# EAGLE design Control.Board (EAGLE 6.6.0)

## Sheet 1 of 8: Интеграция с датчиками
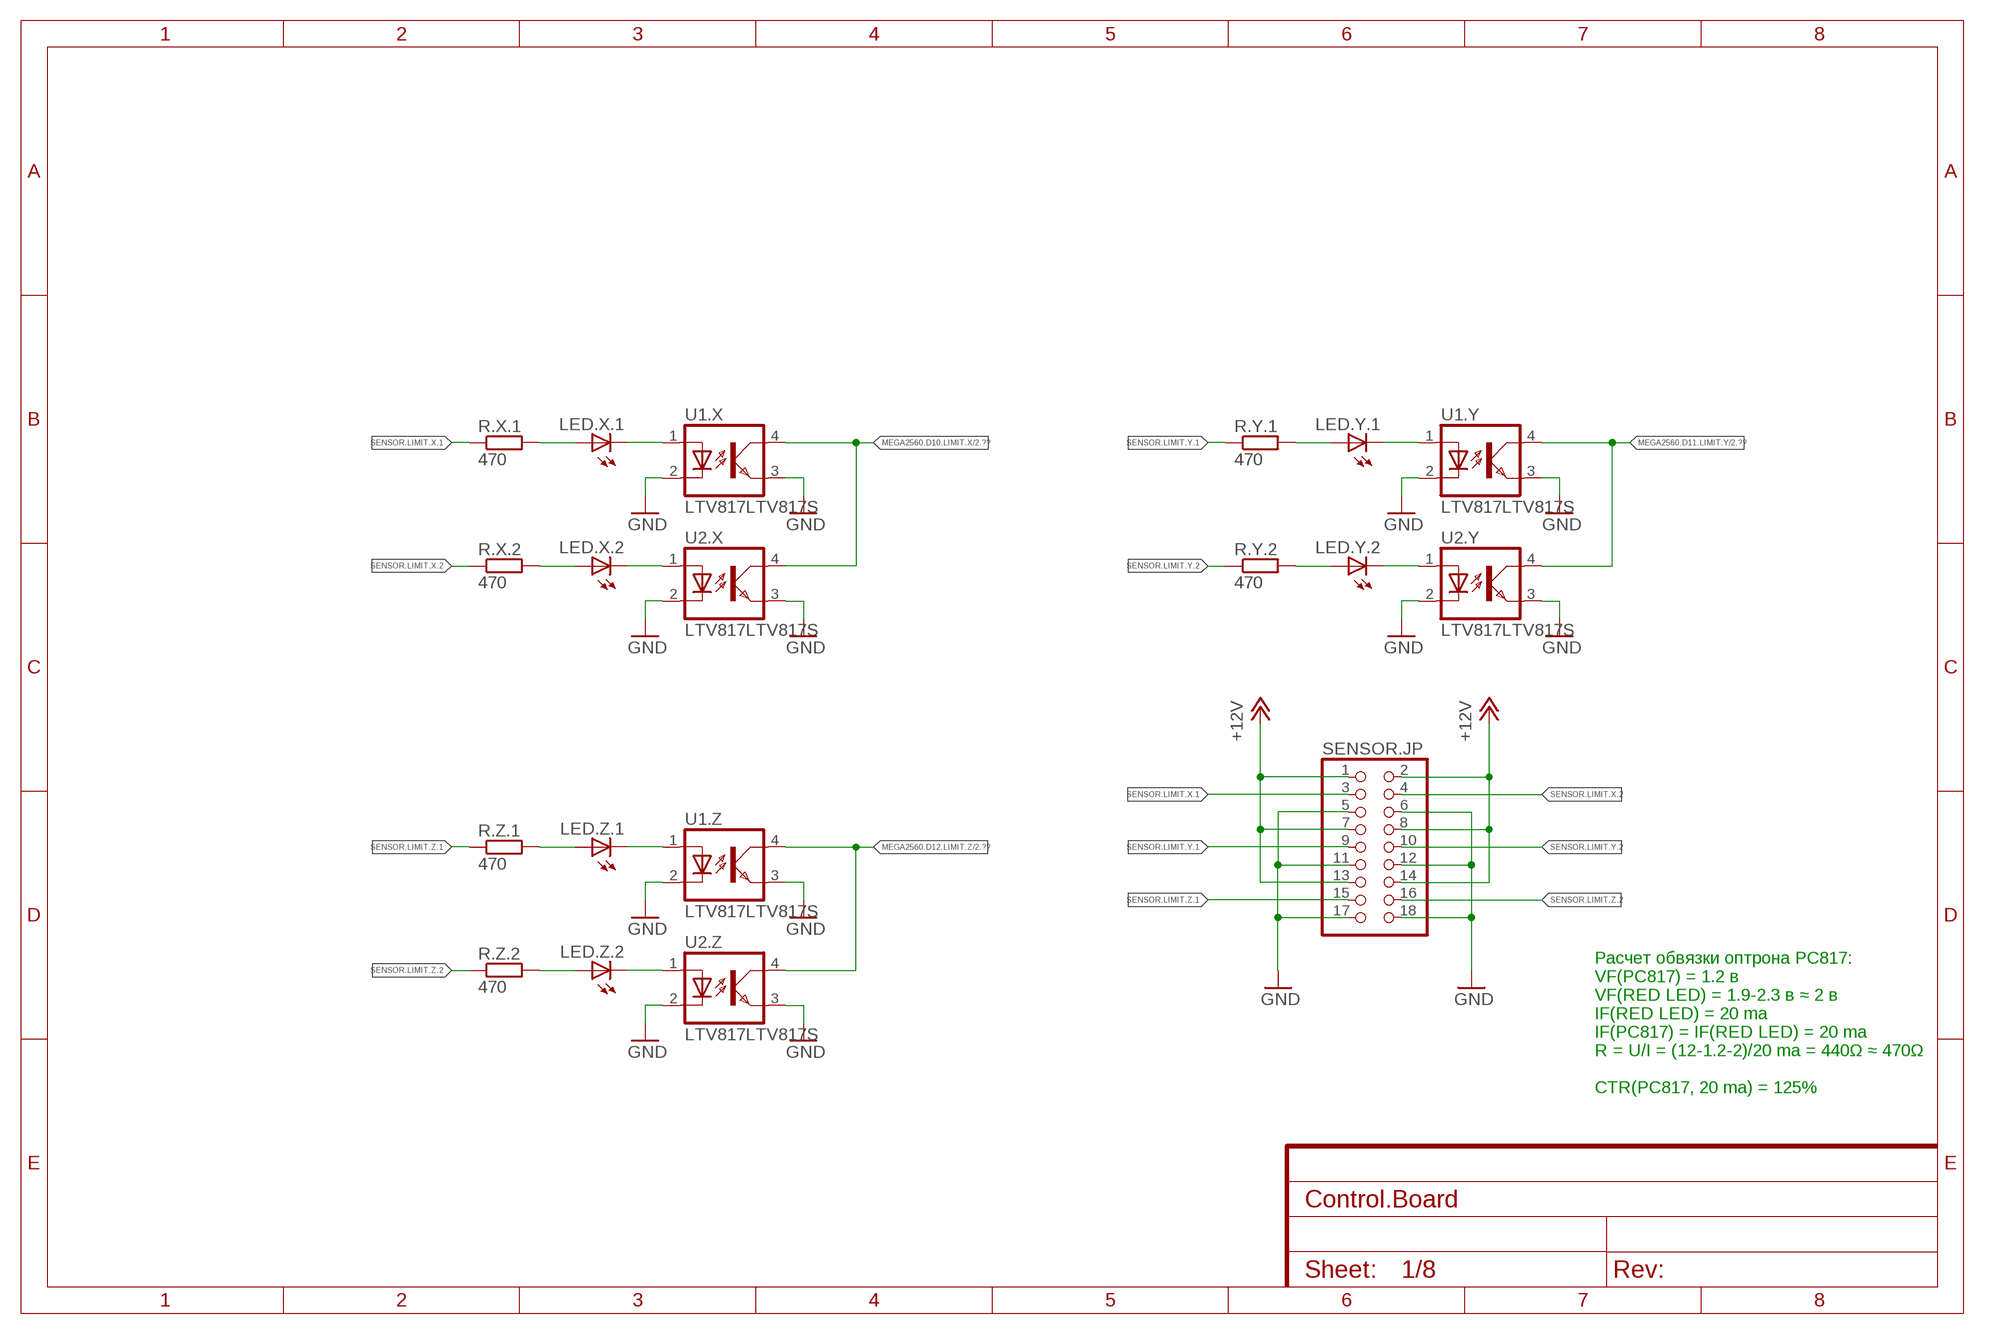
[diagram p0: schematic, sheet 1]

### Parts
LED.X.1  LEDCHIPLED_1206  [CHIPLED_1206]
LED.X.2  LEDCHIPLED_1206  [CHIPLED_1206]
LED.Y.1  LEDCHIPLED_1206  [CHIPLED_1206]
LED.Y.2  LEDCHIPLED_1206  [CHIPLED_1206]
LED.Z.1  LEDCHIPLED_1206  [CHIPLED_1206]
LED.Z.2  LEDCHIPLED_1206  [CHIPLED_1206]
R.X.1  470  R-EU_M1206  [M1206]
R.X.2  470  R-EU_M1206  [M1206]
R.Y.1  470  R-EU_M1206  [M1206]
R.Y.2  470  R-EU_M1206  [M1206]
R.Z.1  470  R-EU_M1206  [M1206]
R.Z.2  470  R-EU_M1206  [M1206]
SENSOR.JP  PINHD-2X9  [2X09]
U1.X  LTV817LTV817S  [DIL4-SMD]
U1.Y  LTV817LTV817S  [DIL4-SMD]
U1.Z  LTV817LTV817S  [DIL4-SMD]
U2.X  LTV817LTV817S  [DIL4-SMD]
U2.Y  LTV817LTV817S  [DIL4-SMD]
U2.Z  LTV817LTV817S  [DIL4-SMD]

### Nets
MEGA2560.D10.LIMIT.X: U1.X.4(COL) U2.X.4(COL) ; also sheet 2,3
MEGA2560.D11.LIMIT.Y: U1.Y.4(COL) U2.Y.4(COL) ; also sheet 2,3
MEGA2560.D12.LIMIT.Z: U1.Z.4(COL) U2.Z.4(COL) ; also sheet 2,3
MEGA2560.GND: SENSOR.JP.5 SENSOR.JP.6 SENSOR.JP.11 SENSOR.JP.12 SENSOR.JP.17 SENSOR.JP.18 U1.X.2(C) U1.X.3(EMIT) U1.Y.2(C) U1.Y.3(EMIT) U1.Z.2(C) U1.Z.3(EMIT) U2.X.2(C) U2.X.3(EMIT) U2.Y.2(C) U2.Y.3(EMIT) U2.Z.2(C) U2.Z.3(EMIT) ; supply symbol labelled GND ; also sheet 2,3,5,6,7,8
MEGA2560.VIN.12V: SENSOR.JP.1 SENSOR.JP.2 SENSOR.JP.7 SENSOR.JP.8 SENSOR.JP.13 SENSOR.JP.14 ; supply symbol labelled +12V ; also sheet 2,3,8
N$1: LED.X.2.C U2.X.1(A)
N$3: LED.Y.1.A R.Y.1.2
N$5: LED.X.1.A R.X.1.2
N$7: LED.X.2.A R.X.2.2
N$8: LED.X.1.C U1.X.1(A)
N$10: LED.Y.2.A R.Y.2.2
N$11: LED.Y.2.C U2.Y.1(A)
N$12: LED.Y.1.C U1.Y.1(A)
N$14: LED.Z.1.A R.Z.1.2
N$16: LED.Z.2.A R.Z.2.2
N$17: LED.Z.2.C U2.Z.1(A)
N$18: LED.Z.1.C U1.Z.1(A)
SENSOR.LIMIT.X.1: R.X.1.1 SENSOR.JP.3
SENSOR.LIMIT.X.2: R.X.2.1 SENSOR.JP.4
SENSOR.LIMIT.Y.1: R.Y.1.1 SENSOR.JP.9
SENSOR.LIMIT.Y.2: R.Y.2.1 SENSOR.JP.10
SENSOR.LIMIT.Z.1: R.Z.1.1 SENSOR.JP.15
SENSOR.LIMIT.Z.2: R.Z.2.1 SENSOR.JP.16

### Notes on the sheet
- Расчет обвязки оптрона PC817:
  VF(PC817) = 1.2 в
  VF(RED LED) = 1.9-2.3 в ≈ 2 в
  IF(RED LED) = 20 ma
  IF(PC817) = IF(RED LED) = 20 ma
  R = U/I = (12-1.2-2)/20 ma = 440Ω ≈ 470Ω
  
  CTR(PC817, 20 ma) = 125%

## Sheet 2 of 8: Внешние устройства
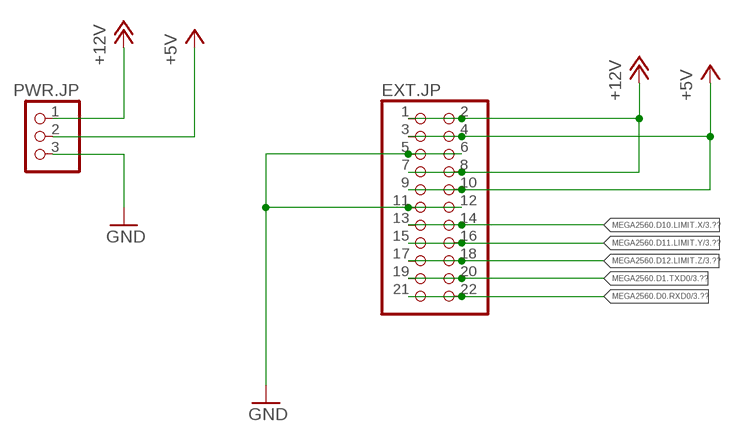
[diagram p1: schematic, sheet 2]

### Parts
EXT.JP  PINHD-2X11  [2X11]
PWR.JP  PINHD-1X3/90  [1X03/90]

### Nets
+5V: EXT.JP.3 EXT.JP.4 EXT.JP.9 EXT.JP.10 PWR.JP.2 ; also sheet 4,5
MEGA2560.D0.RXD0: EXT.JP.21 EXT.JP.22 ; also sheet 3
MEGA2560.D1.TXD0: EXT.JP.19 EXT.JP.20 ; also sheet 3
MEGA2560.D10.LIMIT.X: EXT.JP.13 EXT.JP.14 ; also sheet 1,3
MEGA2560.D11.LIMIT.Y: EXT.JP.15 EXT.JP.16 ; also sheet 1,3
MEGA2560.D12.LIMIT.Z: EXT.JP.17 EXT.JP.18 ; also sheet 1,3
MEGA2560.GND: EXT.JP.5 EXT.JP.6 EXT.JP.11 EXT.JP.12 PWR.JP.3 ; supply symbol labelled GND ; also sheet 1,3,5,6,7,8
MEGA2560.VIN.12V: EXT.JP.1 EXT.JP.2 EXT.JP.7 EXT.JP.8 PWR.JP.1 ; supply symbol labelled +12V ; also sheet 1,3,8

## Sheet 3 of 8: Arduino Mega2560 Shield
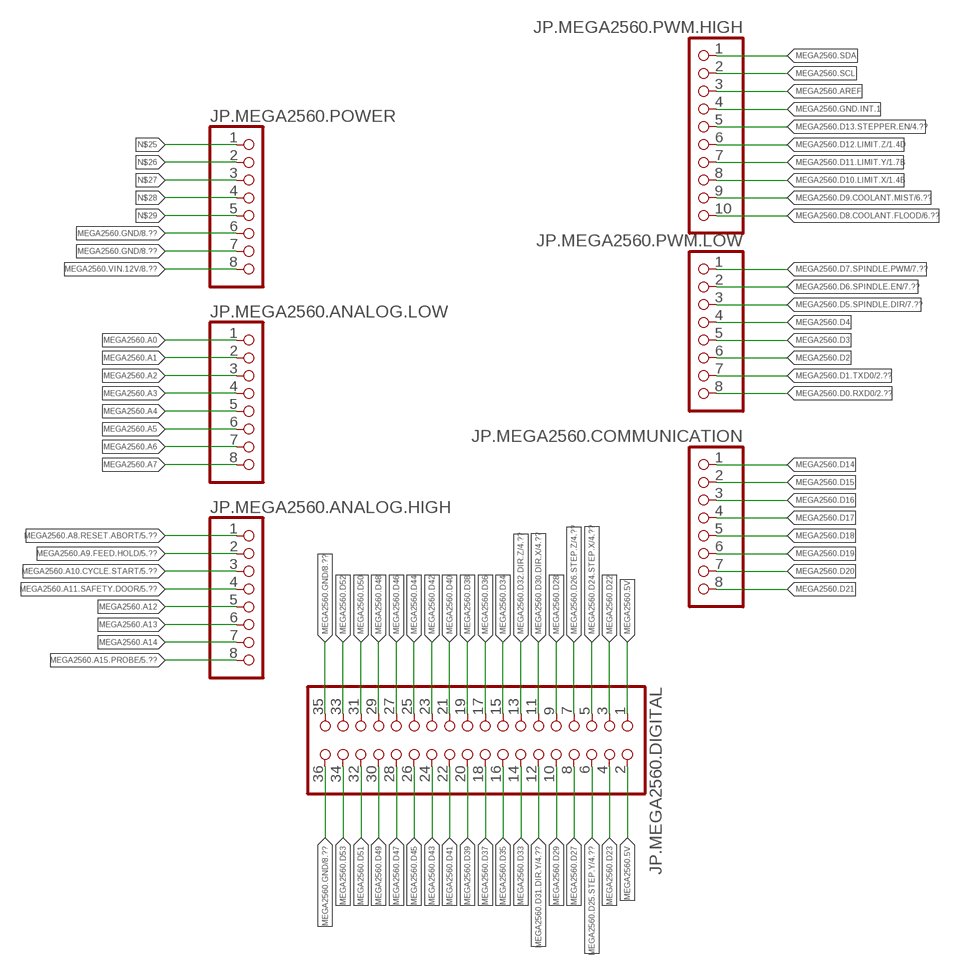
[diagram p2: schematic, sheet 3]

### Parts
JP.MEGA2560.ANALOG.HIGH  PINHD-1X8  [1X08]
JP.MEGA2560.ANALOG.LOW  PINHD-1X8  [1X08]
JP.MEGA2560.COMMUNICATION  PINHD-1X8  [1X08]
JP.MEGA2560.DIGITAL  PINHD-2X18  [2X18]
JP.MEGA2560.POWER  PINHD-1X8  [1X08]
JP.MEGA2560.PWM.HIGH  PINHD-1X10  [1X10]
JP.MEGA2560.PWM.LOW  PINHD-1X8  [1X08]

### Nets
MEGA2560.5V: JP.MEGA2560.DIGITAL.1 JP.MEGA2560.DIGITAL.2
MEGA2560.A0: JP.MEGA2560.ANALOG.LOW.1
MEGA2560.A1: JP.MEGA2560.ANALOG.LOW.2
MEGA2560.A2: JP.MEGA2560.ANALOG.LOW.3
MEGA2560.A3: JP.MEGA2560.ANALOG.LOW.4
MEGA2560.A4: JP.MEGA2560.ANALOG.LOW.5
MEGA2560.A5: JP.MEGA2560.ANALOG.LOW.6
MEGA2560.A6: JP.MEGA2560.ANALOG.LOW.7
MEGA2560.A7: JP.MEGA2560.ANALOG.LOW.8
MEGA2560.A8.RESET.ABORT: JP.MEGA2560.ANALOG.HIGH.1 ; also sheet 5
MEGA2560.A9.FEED.HOLD: JP.MEGA2560.ANALOG.HIGH.2 ; also sheet 5
MEGA2560.A10.CYCLE.START: JP.MEGA2560.ANALOG.HIGH.3 ; also sheet 5
MEGA2560.A11.SAFETY.DOOR: JP.MEGA2560.ANALOG.HIGH.4 ; also sheet 5
MEGA2560.A12: JP.MEGA2560.ANALOG.HIGH.5
MEGA2560.A13: JP.MEGA2560.ANALOG.HIGH.6
MEGA2560.A14: JP.MEGA2560.ANALOG.HIGH.7
MEGA2560.A15.PROBE: JP.MEGA2560.ANALOG.HIGH.8 ; also sheet 5
MEGA2560.AREF: JP.MEGA2560.PWM.HIGH.3
MEGA2560.D0.RXD0: JP.MEGA2560.PWM.LOW.8 ; also sheet 2
MEGA2560.D1.TXD0: JP.MEGA2560.PWM.LOW.7 ; also sheet 2
MEGA2560.D2: JP.MEGA2560.PWM.LOW.6
MEGA2560.D3: JP.MEGA2560.PWM.LOW.5
MEGA2560.D4: JP.MEGA2560.PWM.LOW.4
MEGA2560.D5.SPINDLE.DIR: JP.MEGA2560.PWM.LOW.3 ; also sheet 7
MEGA2560.D6.SPINDLE.EN: JP.MEGA2560.PWM.LOW.2 ; also sheet 7
MEGA2560.D7.SPINDLE.PWM: JP.MEGA2560.PWM.LOW.1 ; also sheet 7
MEGA2560.D8.COOLANT.FLOOD: JP.MEGA2560.PWM.HIGH.10 ; also sheet 6
MEGA2560.D9.COOLANT.MIST: JP.MEGA2560.PWM.HIGH.9 ; also sheet 6
MEGA2560.D10.LIMIT.X: JP.MEGA2560.PWM.HIGH.8 ; also sheet 1,2
MEGA2560.D11.LIMIT.Y: JP.MEGA2560.PWM.HIGH.7 ; also sheet 1,2
MEGA2560.D12.LIMIT.Z: JP.MEGA2560.PWM.HIGH.6 ; also sheet 1,2
MEGA2560.D13.STEPPER.EN: JP.MEGA2560.PWM.HIGH.5 ; also sheet 4
MEGA2560.D14: JP.MEGA2560.COMMUNICATION.1
MEGA2560.D15: JP.MEGA2560.COMMUNICATION.2
MEGA2560.D16: JP.MEGA2560.COMMUNICATION.3
MEGA2560.D17: JP.MEGA2560.COMMUNICATION.4
MEGA2560.D18: JP.MEGA2560.COMMUNICATION.5
MEGA2560.D19: JP.MEGA2560.COMMUNICATION.6
MEGA2560.D20: JP.MEGA2560.COMMUNICATION.7
MEGA2560.D21: JP.MEGA2560.COMMUNICATION.8
MEGA2560.D22: JP.MEGA2560.DIGITAL.3
MEGA2560.D23: JP.MEGA2560.DIGITAL.4
MEGA2560.D24.STEP.X: JP.MEGA2560.DIGITAL.5 ; also sheet 4
MEGA2560.D25.STEP.Y: JP.MEGA2560.DIGITAL.6 ; also sheet 4
MEGA2560.D26.STEP.Z: JP.MEGA2560.DIGITAL.7 ; also sheet 4
MEGA2560.D27: JP.MEGA2560.DIGITAL.8
MEGA2560.D28: JP.MEGA2560.DIGITAL.9
MEGA2560.D29: JP.MEGA2560.DIGITAL.10
MEGA2560.D30.DIR.X: JP.MEGA2560.DIGITAL.11 ; also sheet 4
MEGA2560.D31.DIR.Y: JP.MEGA2560.DIGITAL.12 ; also sheet 4
MEGA2560.D32.DIR.Z: JP.MEGA2560.DIGITAL.13 ; also sheet 4
MEGA2560.D33: JP.MEGA2560.DIGITAL.14
MEGA2560.D34: JP.MEGA2560.DIGITAL.15
MEGA2560.D35: JP.MEGA2560.DIGITAL.16
MEGA2560.D36: JP.MEGA2560.DIGITAL.17
MEGA2560.D37: JP.MEGA2560.DIGITAL.18
MEGA2560.D38: JP.MEGA2560.DIGITAL.19
MEGA2560.D39: JP.MEGA2560.DIGITAL.20
MEGA2560.D40: JP.MEGA2560.DIGITAL.21
MEGA2560.D41: JP.MEGA2560.DIGITAL.22
MEGA2560.D42: JP.MEGA2560.DIGITAL.23
MEGA2560.D43: JP.MEGA2560.DIGITAL.24
MEGA2560.D44: JP.MEGA2560.DIGITAL.25
MEGA2560.D45: JP.MEGA2560.DIGITAL.26
MEGA2560.D46: JP.MEGA2560.DIGITAL.27
MEGA2560.D47: JP.MEGA2560.DIGITAL.28
MEGA2560.D48: JP.MEGA2560.DIGITAL.29
MEGA2560.D49: JP.MEGA2560.DIGITAL.30
MEGA2560.D50: JP.MEGA2560.DIGITAL.31
MEGA2560.D51: JP.MEGA2560.DIGITAL.32
MEGA2560.D52: JP.MEGA2560.DIGITAL.33
MEGA2560.D53: JP.MEGA2560.DIGITAL.34
MEGA2560.GND: JP.MEGA2560.DIGITAL.35 JP.MEGA2560.DIGITAL.36 JP.MEGA2560.POWER.6 JP.MEGA2560.POWER.7 ; also sheet 1,2,5,6,7,8
MEGA2560.GND.INT.1: JP.MEGA2560.PWM.HIGH.4
MEGA2560.SCL: JP.MEGA2560.PWM.HIGH.2
MEGA2560.SDA: JP.MEGA2560.PWM.HIGH.1
MEGA2560.VIN.12V: JP.MEGA2560.POWER.8 ; also sheet 1,2,8
N$25: JP.MEGA2560.POWER.1
N$26: JP.MEGA2560.POWER.2
N$27: JP.MEGA2560.POWER.3
N$28: JP.MEGA2560.POWER.4
N$29: JP.MEGA2560.POWER.5

## Sheet 4 of 8: Connectors
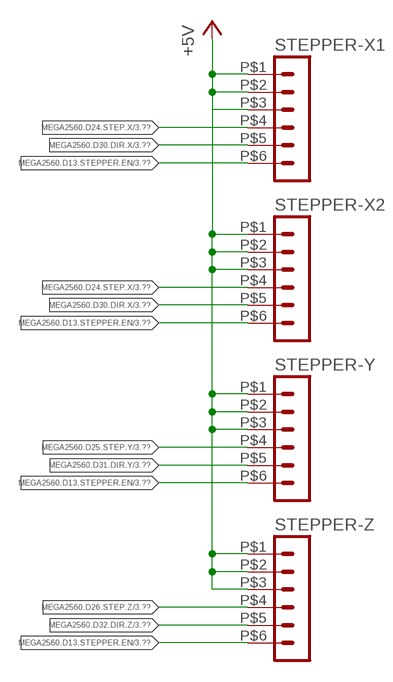
[diagram p3: schematic, sheet 4]

### Parts
STEPPER-X1  HEADER_POS6_43045-0600  [43045-0600]
STEPPER-X2  HEADER_POS6_43045-0600  [43045-0600]
STEPPER-Y  HEADER_POS6_43045-0600  [43045-0600]
STEPPER-Z  HEADER_POS6_43045-0600  [43045-0600]

### Nets
+5V: STEPPER-X1.P$1 STEPPER-X1.P$2 STEPPER-X1.P$3 STEPPER-X2.P$1 STEPPER-X2.P$2 STEPPER-X2.P$3 STEPPER-Y.P$1 STEPPER-Y.P$2 STEPPER-Y.P$3 STEPPER-Z.P$1 STEPPER-Z.P$2 STEPPER-Z.P$3 ; also sheet 2,5
MEGA2560.D13.STEPPER.EN: STEPPER-X1.P$6 STEPPER-X2.P$6 STEPPER-Y.P$6 STEPPER-Z.P$6 ; also sheet 3
MEGA2560.D24.STEP.X: STEPPER-X1.P$4 STEPPER-X2.P$4 ; also sheet 3
MEGA2560.D25.STEP.Y: STEPPER-Y.P$4 ; also sheet 3
MEGA2560.D26.STEP.Z: STEPPER-Z.P$4 ; also sheet 3
MEGA2560.D30.DIR.X: STEPPER-X1.P$5 STEPPER-X2.P$5 ; also sheet 3
MEGA2560.D31.DIR.Y: STEPPER-Y.P$5 ; also sheet 3
MEGA2560.D32.DIR.Z: STEPPER-Z.P$5 ; also sheet 3

## Sheet 5 of 8: Buttons
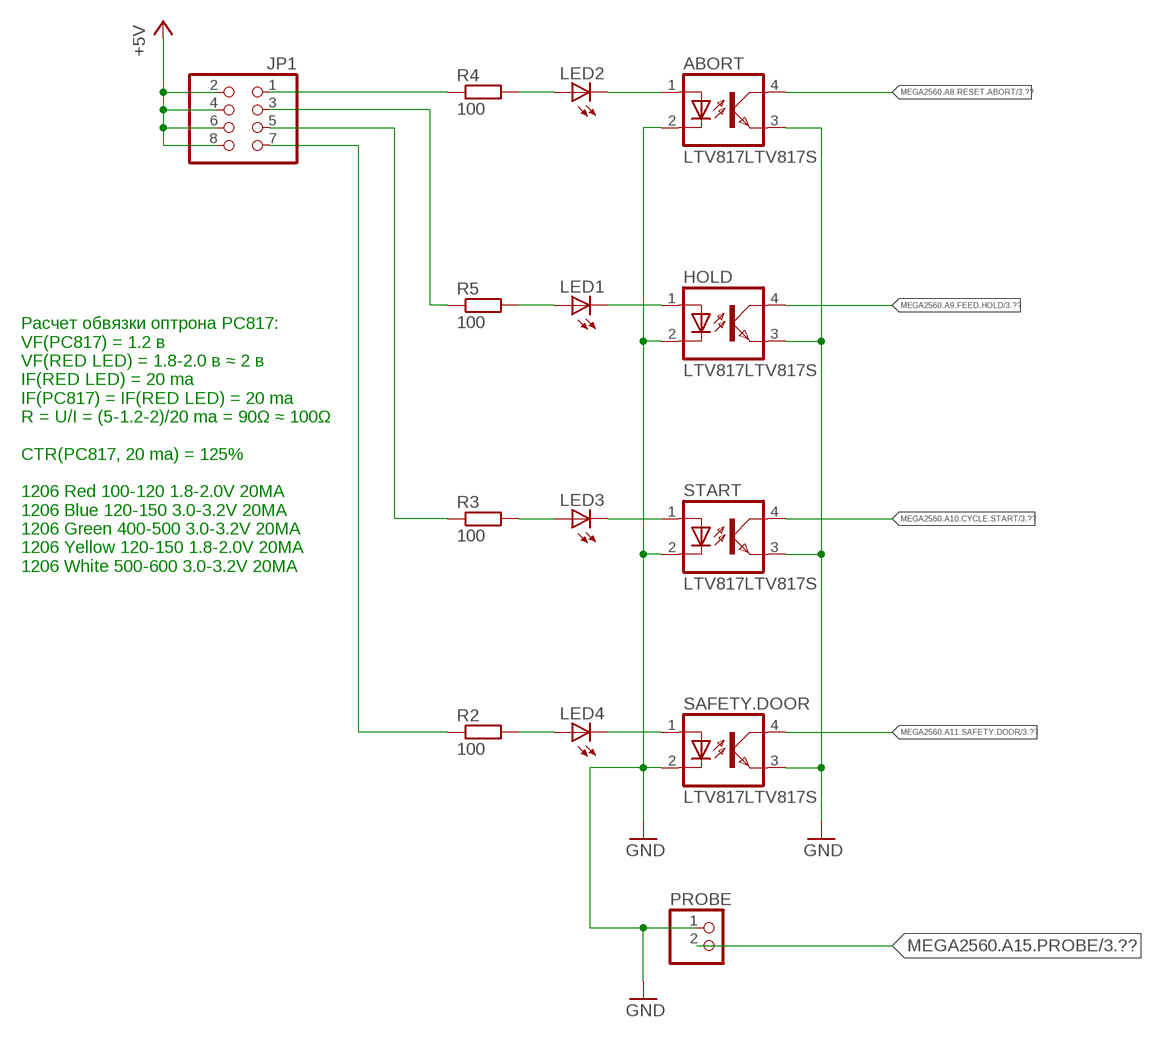
[diagram p4: schematic, sheet 5]

### Parts
ABORT  LTV817LTV817S  [DIL4-SMD]
HOLD  LTV817LTV817S  [DIL4-SMD]
JP1  PINHD-2X4  [2X04]
LED1  LEDCHIPLED_1206  [CHIPLED_1206]
LED2  LEDCHIPLED_1206  [CHIPLED_1206]
LED3  LEDCHIPLED_1206  [CHIPLED_1206]
LED4  LEDCHIPLED_1206  [CHIPLED_1206]
PROBE  PINHD-1X2  [1X02]
R2  100  R-EU_M1206  [M1206]
R3  100  R-EU_M1206  [M1206]
R4  100  R-EU_M1206  [M1206]
R5  100  R-EU_M1206  [M1206]
SAFETY.DOOR  LTV817LTV817S  [DIL4-SMD]
START  LTV817LTV817S  [DIL4-SMD]

### Nets
+5V: JP1.2 JP1.4 JP1.6 JP1.8 ; also sheet 2,4
GND: ABORT.2(C) HOLD.2(C) PROBE.1 SAFETY.DOOR.2(C) START.2(C)
MEGA2560.A8.RESET.ABORT: ABORT.4(COL) ; also sheet 3
MEGA2560.A9.FEED.HOLD: HOLD.4(COL) ; also sheet 3
MEGA2560.A10.CYCLE.START: START.4(COL) ; also sheet 3
MEGA2560.A11.SAFETY.DOOR: SAFETY.DOOR.4(COL) ; also sheet 3
MEGA2560.A15.PROBE: PROBE.2 ; also sheet 3
MEGA2560.GND: ABORT.3(EMIT) HOLD.3(EMIT) SAFETY.DOOR.3(EMIT) START.3(EMIT) ; supply symbol labelled GND ; also sheet 1,2,3,6,7,8
N$19: ABORT.1(A) LED2.C
N$20: JP1.3 R5.1
N$21: JP1.5 R3.1
N$22: HOLD.1(A) LED1.C
N$23: LED1.A R5.2
N$24: LED2.A R4.2
N$30: JP1.1 R4.1
N$31: JP1.7 R2.1
N$32: LED3.A R3.2
N$33: LED3.C START.1(A)
N$34: LED4.C SAFETY.DOOR.1(A)
N$35: LED4.A R2.2

### Notes on the sheet
- Расчет обвязки оптрона PC817:
  VF(PC817) = 1.2 в
  VF(RED LED) = 1.8-2.0 в ≈ 2 в
  IF(RED LED) = 20 ma
  IF(PC817) = IF(RED LED) = 20 ma
  R = U/I = (5-1.2-2)/20 ma = 90Ω ≈ 100Ω
  
  CTR(PC817, 20 ma) = 125%
  
  1206 Red 100-120 1.8-2.0V 20MA
  1206 Blue 120-150 3.0-3.2V 20MA
  1206 Green 400-500 3.0-3.2V 20MA
  1206 Yellow 120-150 1.8-2.0V 20MA
  1206 White 500-600 3.0-3.2V 20MA

## Sheet 6 of 8: Coolant
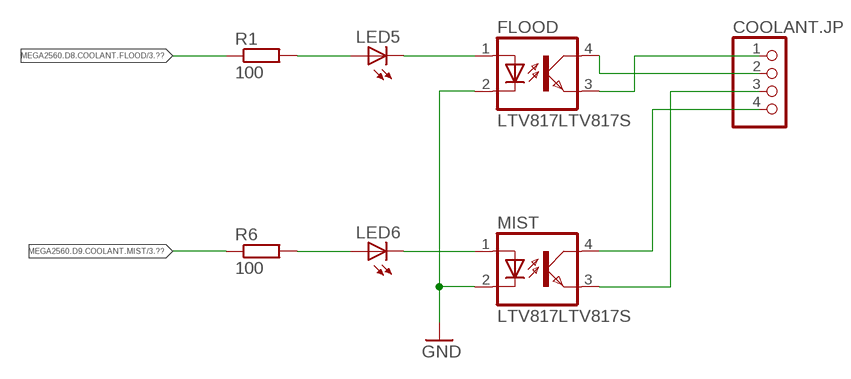
[diagram p5: schematic, sheet 6]

### Parts
COOLANT.JP  PINHD-1X4/90  [1X04/90]
FLOOD  LTV817LTV817S  [DIL4-SMD]
LED5  LEDCHIPLED_1206  [CHIPLED_1206]
LED6  LEDCHIPLED_1206  [CHIPLED_1206]
MIST  LTV817LTV817S  [DIL4-SMD]
R1  100  R-EU_M1206  [M1206]
R6  100  R-EU_M1206  [M1206]

### Nets
MEGA2560.D8.COOLANT.FLOOD: R1.1 ; also sheet 3
MEGA2560.D9.COOLANT.MIST: R6.1 ; also sheet 3
MEGA2560.GND: FLOOD.2(C) MIST.2(C) ; supply symbol labelled GND ; also sheet 1,2,3,5,7,8
N$2: LED5.A R1.2
N$4: FLOOD.1(A) LED5.C
N$6: COOLANT.JP.1 FLOOD.3(EMIT)
N$9: COOLANT.JP.3 MIST.3(EMIT)
N$13: COOLANT.JP.2 FLOOD.4(COL)
N$15: COOLANT.JP.4 MIST.4(COL)
N$36: LED6.A R6.2
N$37: LED6.C MIST.1(A)

## Sheet 7 of 8: Spindle
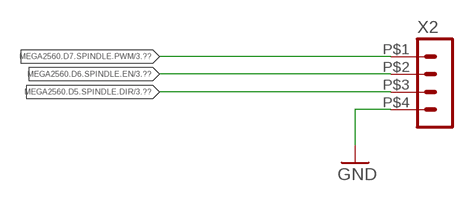
[diagram p6: schematic, sheet 7]

### Parts
X2  HEADER_POS4_43045-0401  [43045-0400]

### Nets
MEGA2560.D5.SPINDLE.DIR: X2.P$3 ; also sheet 3
MEGA2560.D6.SPINDLE.EN: X2.P$2 ; also sheet 3
MEGA2560.D7.SPINDLE.PWM: X2.P$1 ; also sheet 3
MEGA2560.GND: X2.P$4 ; supply symbol labelled GND ; also sheet 1,2,3,5,6,8

## Sheet 8 of 8: Power
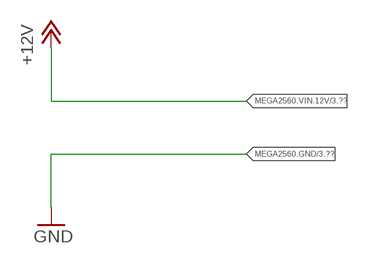
[diagram p7: schematic, sheet 8]

## Library data of the parts
ABORT FLOOD HOLD MIST SAFETY.DOOR START U1.X U1.Y U1.Z U2.X U2.Y U2.Z = net173:LTV817
COOLANT.JP = pinhead:PINHD-1X4: PIN HEADER
EXT.JP = pinhead:PINHD-2X11: PIN HEADER
JP1 = pinhead:PINHD-2X4: PIN HEADER
JP.MEGA2560.ANALOG.HIGH JP.MEGA2560.ANALOG.LOW JP.MEGA2560.COMMUNICATION JP.MEGA2560.POWER JP.MEGA2560.PWM.LOW = pinhead:PINHD-1X8: PIN HEADER
JP.MEGA2560.DIGITAL = pinhead:PINHD-2X18: PIN HEADER
JP.MEGA2560.PWM.HIGH = pinhead:PINHD-1X10: PIN HEADER
LED1-LED6 LED.X.1 LED.X.2 LED.Y.1 LED.Y.2 LED.Z.1 LED.Z.2 = led:LED: LED OSRAM: - CHIPLED LG R971, LG N971, LY N971, LG Q971, LY Q971, LO R971, LY R971 LH N974, LH R974 LS Q976, LO Q976, LY Q976 LO Q996 - Hyper CHIPLED LW Q18S LB Q993, LB Q99A, LB R99A - SideLED LS A670, LO A670, LY A670, LG A670, LP A670 LB A673, LV A673, LT A673, LW A673 LH A674 LY A675 LS A676, LA A676, LO A676, LY A676, LW A676 LS A679, LY A679, LG A679 - Hyper Micro SIDELED® LS Y876, LA Y876, LO Y876, LY Y876 LT Y87S - SmartLED LW L88C, LW L88S LB L89C, LB L89S, LG L890 LS L89K, LO L89K, LY L89K LS L896, LA L896, LO L896, LY L896 - TOPLED LS T670, LO T670, LY T670, LG T670, LP T670 LSG T670, LSP T670, LSY T670, LOP T670, LYG T670 LG T671, LOG T671, LSG T671 LB T673, LV T673, LT T673, LW T673 LH T674 LS T676, LA T676, LO T676, LY T676, LB T676, LH T676, LSB T676, LW T676 LB T67C, LV T67C, LT T67C, LS T67K, LO T67K, LY T67K, LW E67C LS E67B, LA E67B, LO E67B, LY E67B, LB E67C, LV E67C, LT E67C LW T67C LS T679, LY T679, LG T679 LS T770, LO T770, LY T770, LG T770, LP T770 LB T773, LV T773, LT T773, LW T773 LH T774 LS E675, LA E675, LY E675, LS T675 LS T776, LA T776, LO T776, LY T776, LB T776 LHGB T686 LT T68C, LB T68C - Hyper Mini TOPLED® LB M676 - Mini TOPLED Santana® LG M470 LS M47K, LO M47K, LY M47K Source: http://www.osram.convergy.de LUXEON: - LUMILED® LXK2-PW12-R00, LXK2-PW12-S00, LXK2-PW14-U00, LXK2-PW14-V00 LXK2-PM12-R00, LXK2-PM12-S00, LXK2-PM14-U00 LXK2-PE12-Q00, LXK2-PE12-R00, LXK2-PE12-S00, LXK2-PE14-T00, LXK2-PE14-U00 LXK2-PB12-K00, LXK2-PB12-L00, LXK2-PB12-M00, LXK2-PB14-N00, LXK2-PB14-P00, LXK2-PB14-Q00 LXK2-PR12-L00, LXK2-PR12-M00, LXK2-PR14-Q00, LXK2-PR14-R00 LXK2-PD12-Q00, LXK2-PD12-R00, LXK2-PD12-S00 LXK2-PH12-R00, LXK2-PH12-S00 LXK2-PL12-P00, LXK2-PL12-Q00, LXK2-PL12-R00 Source: www.luxeon.com KINGBRIGHT: KA-3528ASYC Source: www.kingbright.com
PROBE = pinhead:PINHD-1X2: PIN HEADER
PWR.JP = pinhead:PINHD-1X3: PIN HEADER
R1-R6 R.X.1 R.X.2 R.Y.1 R.Y.2 R.Z.1 R.Z.2 = rcl:R-EU_: RESISTOR, European symbol
SENSOR.JP = pinhead:PINHD-2X9: PIN HEADER
STEPPER-X1 STEPPER-X2 STEPPER-Y STEPPER-Z = con-molex-micro-fit-3_0:HEADER_POS6_?: Molex - Micro-Fit 3.0 Series connector, 3.00mm (0.118") pitch header, 6 positions.
X2 = con-molex-micro-fit-3_0:HEADER_POS4_?: Molex - Micro-Fit 3.0 Series connector, 3.00mm (0.118") pitch header, 4 positions.

## Board
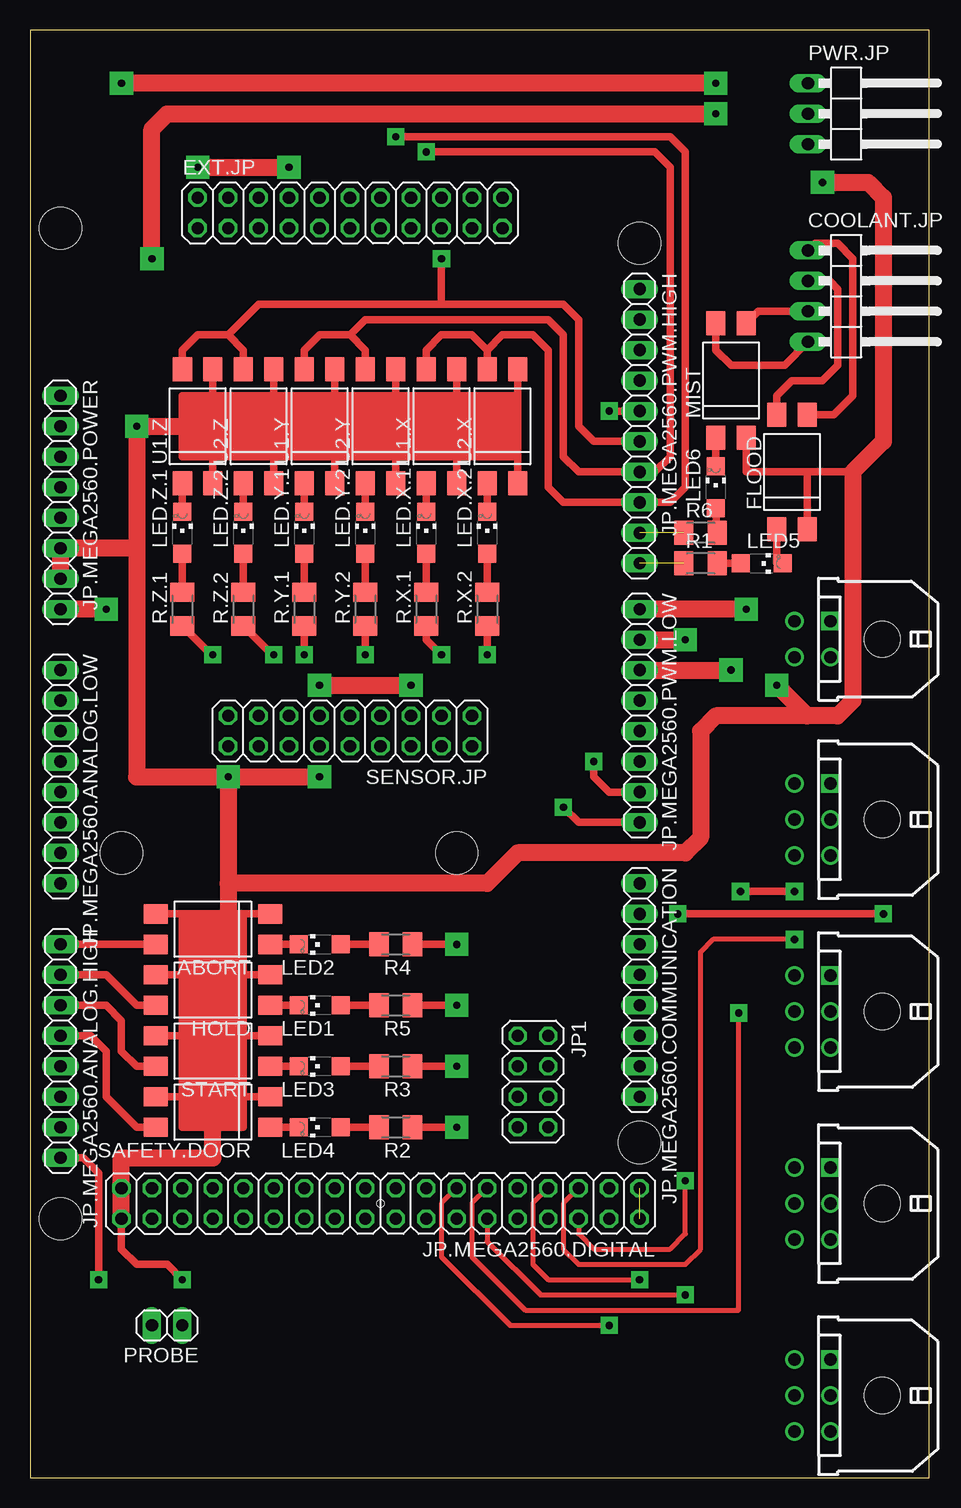
[diagram p8: board, top side]
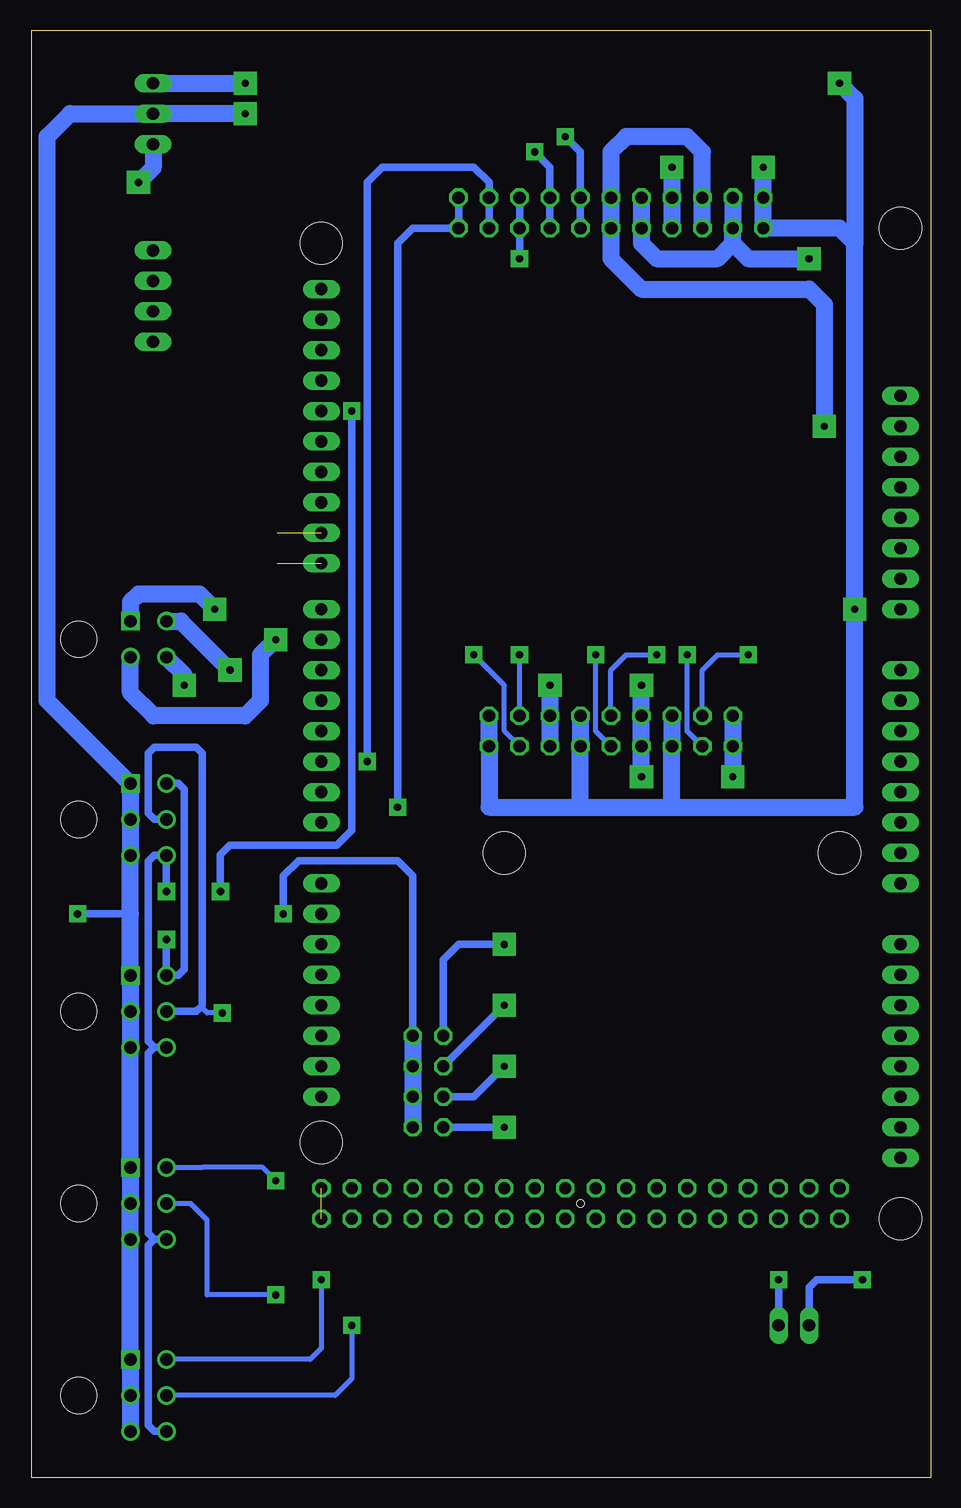
[diagram p9: board, bottom side, seen from below]

Size 74.93 x 120.65 mm. Coordinates in mm from the lower left corner, seen from the top.
Outline: 0,0 74.93,0 74.93,120.65 0,120.65 0,0
Copper layers (1*16): Top 0.035mm / dielectric 1.5mm / Bottom 0.035mm
Design rules "default": minimum track width 10mil, minimum drill 24mil, track to track 8mil, track to pad 8mil, pad to pad 8mil, via to via 8mil, smd to smd 8mil, copper to edge 40mil, drill to drill 8mil, minimum pad ring 10mil, minimum via ring 8mil, stop-mask expansion 4mil, vias tented up to drill 0mil, thermal gap 10mil
Holes 0.6 mm at 29.21,22.86
Holes 3.5 mm at 2.54,21.59 50.8,27.94 50.8,102.87 2.54,104.14 7.62,52.07 35.56,52.07

### Footprints (pad centres in the part's own frame; a part is rotated, then mirrored left to right if it is on the bottom)
DIL4-SMD = smd 1.6 x 2: 1 -1.27,-4.77; 2 1.27,-4.77; 3 1.27,4.77; 4 -1.27,4.77
1X04/90 = drill 1.016 long: 1 -3.81,-3.81; 2 -1.27,-3.81; 3 1.27,-3.81; 4 3.81,-3.81
2X11 = drill 1.016 octagon: 1 -12.7,-1.27; 2 -12.7,1.27; 3 -10.16,-1.27; 4 -10.16,1.27; 5 -7.62,-1.27; 6 -7.62,1.27; 7 -5.08,-1.27; 8 -5.08,1.27; 9 -2.54,-1.27; 10 -2.54,1.27; 11 0,-1.27; 12 0,1.27; 13 2.54,-1.27; 14 2.54,1.27; 15 5.08,-1.27; 16 5.08,1.27; 17 7.62,-1.27; 18 7.62,1.27; 19 10.16,-1.27; 20 10.16,1.27; 21 12.7,-1.27; 22 12.7,1.27
2X04 = drill 1.016 octagon: 1 -3.81,-1.27; 2 -3.81,1.27; 3 -1.27,-1.27; 4 -1.27,1.27; 5 1.27,-1.27; 6 1.27,1.27; 7 3.81,-1.27; 8 3.81,1.27
1X08 = drill 1.016 long: 1 -8.89,0; 2 -6.35,0; 3 -3.81,0; 4 -1.27,0; 5 1.27,0; 6 3.81,0; 7 6.35,0; 8 8.89,0
2X18 = drill 1.016 octagon: 1 -21.59,-1.27; 2 -21.59,1.27; 3 -19.05,-1.27; 4 -19.05,1.27; 5 -16.51,-1.27; 6 -16.51,1.27; 7 -13.97,-1.27; 8 -13.97,1.27; 9 -11.43,-1.27; 10 -11.43,1.27; 11 -8.89,-1.27; 12 -8.89,1.27; 13 -6.35,-1.27; 14 -6.35,1.27; 15 -3.81,-1.27; 16 -3.81,1.27; 17 -1.27,-1.27; 18 -1.27,1.27; 19 1.27,-1.27; 20 1.27,1.27; 21 3.81,-1.27; 22 3.81,1.27; 23 6.35,-1.27; 24 6.35,1.27; 25 8.89,-1.27; 26 8.89,1.27; 27 11.43,-1.27; 28 11.43,1.27; 29 13.97,-1.27; 30 13.97,1.27; 31 16.51,-1.27; 32 16.51,1.27; 33 19.05,-1.27; 34 19.05,1.27; 35 21.59,-1.27; 36 21.59,1.27
1X10 = drill 1.016 long: 1 -11.43,0; 2 -8.89,0; 3 -6.35,0; 4 -3.81,0; 5 -1.27,0; 6 1.27,0; 7 3.81,0; 8 6.35,0; 9 8.89,0; 10 11.43,0
CHIPLED_1206 = smd 1.5 x 1.5: A 0,-1.75; C 0,1.75
1X02 = drill 1.016 long: 1 -1.27,0; 2 1.27,0
1X03/90 = drill 1.016 long: 1 -2.54,-3.81; 2 0,-3.81; 3 2.54,-3.81
M1206 = smd 1.6 x 2: 1 -1.4,0; 2 1.4,0
2X09 = drill 1.016 octagon: 1 -10.16,-1.27; 2 -10.16,1.27; 3 -7.62,-1.27; 4 -7.62,1.27; 5 -5.08,-1.27; 6 -5.08,1.27; 7 -2.54,-1.27; 8 -2.54,1.27; 9 0,-1.27; 10 0,1.27; 11 2.54,-1.27; 12 2.54,1.27; 13 5.08,-1.27; 14 5.08,1.27; 15 7.62,-1.27; 16 7.62,1.27; 17 10.16,-1.27; 18 10.16,1.27
43045-0600 = drill 1.02 square: P$1 3,4.32 | drill 1.02: P$2 0,4.32; P$3 -3,4.32; P$4 3,7.32; P$5 0,7.32; P$6 -3,7.32 | hole 3: 0,0
43045-0400 = drill 1.02 square: P$1 1.5,4.32 | drill 1.02: P$2 -1.5,4.32; P$3 1.5,7.32; P$4 -1.5,7.32 | hole 3: 0,0

### Placement (x,y rotation side)
ABORT  15.24,45.72 90 top
COOLANT.JP  68.64,98.47 270 top
EXT.JP  26.67,105.41 0 top
FLOOD  63.5,83.82 0 top
HOLD  15.24,40.64 90 top
JP1  41.91,33.02 270 top
JP.MEGA2560.ANALOG.HIGH  2.54,35.56 270 top
JP.MEGA2560.ANALOG.LOW  2.54,58.42 270 top
JP.MEGA2560.COMMUNICATION  50.8,40.64 270 top
JP.MEGA2560.DIGITAL  29.21,22.86 180 top
JP.MEGA2560.POWER  2.54,81.28 270 top
JP.MEGA2560.PWM.HIGH  50.8,87.63 270 top
JP.MEGA2560.PWM.LOW  50.8,63.5 270 top
LED1  24.13,39.37 90 top
LED2  24.13,44.45 90 top
LED3  24.13,34.29 90 top
LED4  24.13,29.21 90 top
LED5  60.96,76.2 270 top
LED6  57.15,82.55 0 top
LED.X.1  33.02,78.74 0 top
LED.X.2  38.1,78.74 0 top
LED.Y.1  22.86,78.74 0 top
LED.Y.2  27.94,78.74 0 top
LED.Z.1  12.7,78.74 0 top
LED.Z.2  17.78,78.74 0 top
MIST  58.42,91.44 0 top
PROBE  11.43,12.7 180 top
PWR.JP  68.64,113.68 270 top
R1  55.88,76.2 0 top
R2  30.48,29.21 180 top
R3  30.48,34.29 180 top
R4  30.48,44.45 180 top
R5  30.48,39.37 180 top
R6  55.88,78.74 0 top
R.X.1  33.02,72.39 90 top
R.X.2  38.1,72.39 90 top
R.Y.1  22.86,72.39 90 top
R.Y.2  27.94,72.39 90 top
R.Z.1  12.7,72.39 90 top
R.Z.2  17.78,72.39 90 top
SAFETY.DOOR  15.24,30.48 90 top
SENSOR.JP  26.67,62.23 180 top
START  15.24,35.56 90 top
STEPPER-X1  71.03,54.86 90 top
STEPPER-X2  71.03,38.86 90 top
STEPPER-Y  71.03,22.86 90 top
STEPPER-Z  71.03,6.86 90 top
U1.X  34.29,87.63 0 top
U1.Y  24.13,87.63 0 top
U1.Z  13.97,87.63 0 top
U2.X  39.37,87.63 0 top
U2.Y  29.21,87.63 0 top
U2.Z  19.05,87.63 0 top
X2  71.03,69.89 90 top

### Tracks (layer width: path | path; a pad name or v marks a point on that pad's centre or on a via)
+5V  (via drill 0.6 pad 1.42, 0.6 pad 1.93)
  Top 0.61: v53.97,46.99 v71.12,46.99
  Top 1.422: v10.16,101.6 10.16,112.39 11.43,113.67 v57.15,113.67
  Bottom 0.61: JP1.2 43.18,50.16 44.45,51.44 52.7,51.44 53.97,50.16 v53.97,46.99 | v71.12,46.99 66.71,46.99
  Bottom 1.422: STEPPER-Z.P$3 STEPPER-Z.P$2 STEPPER-Z.P$1 STEPPER-Y.P$3 STEPPER-Y.P$2 STEPPER-Y.P$1 STEPPER-X2.P$3 STEPPER-X2.P$2 STEPPER-X2.P$1 66.71,46.99 STEPPER-X1.P$3 STEPPER-X1.P$2 STEPPER-X1.P$1 66.75,57.86 73.66,64.77 73.66,111.76 71.74,113.68 65.4,113.68 | JP1.2 JP1.4 JP1.6 JP1.8 | EXT.JP.9 EXT.JP.10 24.13,102.87 22.86,101.6 17.78,101.6 16.51,102.87 | 65.4,113.68 PWR.JP.2 64.81,113.67 | EXT.JP.4 EXT.JP.3 16.51,102.87 | 16.51,102.87 15.24,101.6 v10.16,101.6 | v57.15,113.67 65.39,113.67 65.4,113.68
GND  (via drill 0.6 pad 1.42)
  Top 0.61: 20.32,41.91 HOLD.2 17.78,41.91 | 17.78,36.83 17.78,31.75 SAFETY.DOOR.2 15.24,31.75 15.24,26.67 7.62,26.67 7.62,19.05 8.89,17.78 11.43,17.78 v12.7,16.51 | START.2 17.78,36.83 | 17.78,36.83 17.78,41.91 | 17.78,41.91 17.78,46.99 ABORT.2
  Bottom 0.61: v12.7,16.51 PROBE.1
MEGA2560.5V  (1 unrouted)
MEGA2560.A8.RESET.ABORT
  Top 0.61: ABORT.4 JP.MEGA2560.ANALOG.HIGH.1
MEGA2560.A9.FEED.HOLD
  Top 0.61: HOLD.4 8.89,39.37 6.35,41.91 JP.MEGA2560.ANALOG.HIGH.2
MEGA2560.A10.CYCLE.START
  Top 0.61: START.4 8.89,34.29 7.62,35.56 7.62,38.1 6.35,39.37 JP.MEGA2560.ANALOG.HIGH.3
MEGA2560.A11.SAFETY.DOOR
  Top 0.61: SAFETY.DOOR.4 8.89,29.21 6.35,31.75 6.35,35.56 5.08,36.83 JP.MEGA2560.ANALOG.HIGH.4
MEGA2560.A15.PROBE  (via drill 0.6 pad 1.42)
  Top 0.61: JP.MEGA2560.ANALOG.HIGH.8 4.44,26.67 5.71,25.4 v5.71,16.51
  Bottom 0.61: v5.71,16.51 9.52,16.51 10.16,15.88 PROBE.2
MEGA2560.D0.RXD0  (via drill 0.6 pad 1.42)
  Top 0.61: JP.MEGA2560.PWM.LOW.8 45.72,54.61 v44.45,55.88
  Bottom 0.61: EXT.JP.22 EXT.JP.21 43.18,104.14 44.45,102.87 v44.45,55.88
MEGA2560.D1.TXD0  (via drill 0.6 pad 1.42)
  Top 0.61: JP.MEGA2560.PWM.LOW.7 48.26,57.15 46.99,58.42 v46.99,59.69
  Bottom 0.61: EXT.JP.19 EXT.JP.20 36.83,107.95 38.1,109.22 45.72,109.22 46.99,107.95 v46.99,59.69
MEGA2560.D5.SPINDLE.DIR  (via drill 0.6 pad 1.93)
  Top 1.422: JP.MEGA2560.PWM.LOW.3 v58.42,67.31
  Bottom 1.422: X2.P$3 62.5,71.39 v58.42,67.31
MEGA2560.D6.SPINDLE.EN  (via drill 0.6 pad 1.93)
  Top 1.422: JP.MEGA2560.PWM.LOW.2 v54.61,69.85
  Bottom 1.422: v54.61,69.85 55.88,68.58 55.88,64.77 57.15,63.5 64.77,63.5 66.71,65.44 X2.P$2
MEGA2560.D7.SPINDLE.PWM  (via drill 0.6 pad 1.93)
  Top 1.422: v59.69,72.39 JP.MEGA2560.PWM.LOW.1
  Bottom 1.422: v59.69,72.39 60.96,73.66 66.04,73.66 66.71,72.99 X2.P$1
MEGA2560.D8.COOLANT.FLOOD  (1 unrouted)
MEGA2560.D9.COOLANT.MIST  (1 unrouted)
MEGA2560.D10.LIMIT.X  (via drill 0.6 pad 1.42)
  Top 0.61: U1.X.4 33.02,93.98 34.29,95.25 36.83,95.25 38.1,93.98 | U2.X.4 38.1,93.98 | 38.1,93.98 39.37,95.25 41.91,95.25 43.18,93.98 43.18,82.55 44.45,81.28 JP.MEGA2560.PWM.HIGH.8 53.34,81.28 54.61,82.55 54.61,110.49 53.34,111.76 v30.48,111.76
  Bottom 0.61: EXT.JP.14 EXT.JP.13 29.21,110.49 v30.48,111.76
MEGA2560.D11.LIMIT.Y  (via drill 0.6 pad 1.42)
  Top 0.61: U1.Y.4 22.86,93.98 24.13,95.25 26.67,95.25 | 26.67,95.25 27.94,93.98 U2.Y.4 | 26.67,95.25 27.94,96.52 43.18,96.52 44.45,95.25 44.45,85.09 45.72,83.82 JP.MEGA2560.PWM.HIGH.7 52.07,83.82 53.34,85.09 53.34,109.22 52.07,110.49 v33.02,110.49
  Bottom 0.61: EXT.JP.15 EXT.JP.16 31.75,109.22 v33.02,110.49
MEGA2560.D12.LIMIT.Z  (via drill 0.6 pad 1.42)
  Top 0.61: U2.Z.4 17.78,93.98 16.51,95.25 | U1.Z.4 12.7,93.98 13.97,95.25 16.51,95.25 | JP.MEGA2560.PWM.HIGH.6 46.99,86.36 45.72,87.63 45.72,96.52 44.45,97.79 34.29,97.79 | 34.29,97.79 19.05,97.79 16.51,95.25 | v34.29,101.6 34.29,97.79
  Bottom 0.61: EXT.JP.18 EXT.JP.17 v34.29,101.6
MEGA2560.D13.STEPPER.EN  (via drill 0.6 pad 1.42)
  Top 0.61: JP.MEGA2560.PWM.HIGH.5 v48.26,88.9 | v63.71,48.86 v59.21,48.86
  Bottom 0.61: STEPPER-Z.P$6 64.71,3.86 65.21,4.36 65.21,19.36 64.71,19.86 | STEPPER-Y.P$6 64.71,19.86 | 64.71,19.86 65.21,20.36 65.21,35.36 64.71,35.86 | STEPPER-X2.P$6 64.71,35.86 | 64.71,35.86 65.21,36.36 65.21,51.36 64.71,51.86 STEPPER-X1.P$6 v63.71,48.86 | v48.26,88.9 48.26,53.97 49.53,52.7 58.42,52.7 59.21,51.91 v59.21,48.86
MEGA2560.D24.STEP.X  (via drill 0.6 pad 1.42)
  Top 0.406: v63.71,44.86 56.92,44.86 55.88,43.81 55.88,19.05 54.61,17.78 45.72,17.78 44.45,19.05 44.45,22.86 JP.MEGA2560.DIGITAL.5
  Bottom 0.61: STEPPER-X1.P$4 62.71,57.86 62.21,57.36 62.21,42.36 62.71,41.86 STEPPER-X2.P$4 v63.71,44.86
MEGA2560.D25.STEP.Y  (via drill 0.6 pad 1.42)
  Top 0.406: JP.MEGA2560.DIGITAL.6 45.72,20.32 46.99,19.05 53.34,19.05 54.61,20.32 v54.61,24.77
  Bottom 0.406: STEPPER-Y.P$4 60.71,25.86 55.7,25.86 v54.61,24.77
MEGA2560.D26.STEP.Z  (via drill 0.6 pad 1.42)
  Top 0.406: JP.MEGA2560.DIGITAL.7 41.91,22.86 41.91,17.78 43.18,16.51 v50.8,16.51
  Bottom 0.406: v50.8,16.51 50.8,10.79 51.73,9.86 STEPPER-Z.P$4
MEGA2560.D30.DIR.X  (via drill 0.6 pad 1.42)
  Top 0.406: JP.MEGA2560.DIGITAL.11 36.83,22.86 36.83,18.41 41.27,13.97 59.05,13.97 v59.05,38.73
  Bottom 0.406: v59.05,38.73 60.33,38.73 60.83,39.24
  Bottom 0.61: STEPPER-X1.P$5 64.71,54.86 65.21,55.36 65.21,60.36 64.71,60.86 61.21,60.86 60.71,60.36 60.71,39.36 60.83,39.24 61.21,38.86 STEPPER-X2.P$5
MEGA2560.D31.DIR.Y  (via drill 0.6 pad 1.42)
  Top 0.406: JP.MEGA2560.DIGITAL.12 38.1,19.68 42.55,15.24 v54.61,15.24
  Bottom 0.406: STEPPER-Y.P$5 61.71,22.86 60.33,21.47 60.33,15.24 v54.61,15.24
MEGA2560.D32.DIR.Z  (via drill 0.6 pad 1.42)
  Top 0.406: JP.MEGA2560.DIGITAL.13 34.29,22.86 34.29,18.41 40,12.7 v48.26,12.7
  Bottom 0.406: STEPPER-Z.P$5 49.65,6.86 48.26,8.25 v48.26,12.7
MEGA2560.GND  (via drill 0.6 pad 1.93)
  Top 0.61: 35.56,90.17 U1.X.2 | U2.X.3 40.64,90.17 | U1.Y.2 25.4,90.17 | 25.4,90.17 U1.Y.3 | U2.Y.2 30.48,90.17 | U1.X.3 35.56,90.17 | 35.56,90.17 40.64,90.17 | U2.X.2 40.64,85.09 | 40.64,85.09 40.64,90.17 | 30.48,90.17 25.4,90.17 | SAFETY.DOOR.3 12.7,31.75 | 12.7,31.75 15.24,31.75 17.78,31.75 | 12.7,36.83 12.7,31.75 | START.3 12.7,36.83 | HOLD.3 12.7,41.91 | 12.7,41.91 12.7,36.83 | ABORT.3 12.7,46.99 | 12.7,46.99 12.7,41.91 | 12.7,46.99 16.51,46.99 17.78,46.99 17.78,31.75 | U2.Z.2 20.32,90.17 | 20.32,90.17 15.24,90.17 | 15.24,90.17 15.24,87.63 15.24,85.09 | U1.Z.3 15.24,90.17 | U2.Z.3 20.32,90.17 | 20.32,90.17 25.4,90.17 | U2.Y.3 30.48,90.17 | 30.48,90.17 35.56,90.17 | U1.Z.2 15.24,85.09 | 15.24,85.09 40.64,85.09 | 15.24,85.09 12.7,85.09 12.7,90.17 15.24,90.17 | 17.78,31.75 17.78,29.21 12.7,29.21 12.7,31.75 | 64.77,83.82 59.69,83.82 MIST.2 | 64.77,83.82 FLOOD.2 | 64.77,83.82 68.58,83.82
  Top 1.422: v16.51,58.42 v24.13,58.42 | v24.13,66.04 v31.75,66.04 | 15.24,87.63 v8.89,87.63 8.89,77.47 | v16.51,58.42 16.51,49.53 | 16.51,49.53 16.51,46.99 | 8.89,77.47 JP.MEGA2560.POWER.6 JP.MEGA2560.POWER.7 | JP.MEGA2560.DIGITAL.36 JP.MEGA2560.DIGITAL.35 7.62,26.67 15.24,26.67 15.24,31.75 | 8.89,77.47 8.89,58.42 v16.51,58.42 | 64.77,63.5 67.31,63.5 68.58,64.77 68.58,83.82 71.12,86.36 71.12,106.68 69.85,107.95 v66.04,107.95 | 64.77,63.5 v62.23,66.04 | 64.77,63.5 57.15,63.5 55.88,62.23 55.88,53.34 54.61,52.07 40.64,52.07 38.1,49.53 16.51,49.53
  Bottom 1.422: SENSOR.JP.17 SENSOR.JP.18 v16.51,58.42 | SENSOR.JP.6 SENSOR.JP.5 v31.75,66.04 | v24.13,58.42 SENSOR.JP.12 SENSOR.JP.11 v24.13,66.04 | EXT.JP.5 EXT.JP.6 19.05,110.49 20.32,111.76 25.4,111.76 26.67,110.49 EXT.JP.12 EXT.JP.11 26.67,101.6 24.13,99.06 10.16,99.06 8.89,97.79 v8.89,87.63 | v62.23,66.04 62.23,66.91 X2.P$4 | PWR.JP.3 64.83,109.16 v66.04,107.95
MEGA2560.VIN.12V  (via drill 0.6 pad 1.93)
  Top 1.422: v13.97,109.22 v21.59,109.22 | v6.35,72.39 JP.MEGA2560.POWER.8 | v57.15,116.2 v7.62,116.2
  Bottom 1.422: SENSOR.JP.1 SENSOR.JP.2 36.83,55.88 29.21,55.88 | 29.21,55.88 SENSOR.JP.8 SENSOR.JP.7 | 29.21,55.88 21.59,55.88 | 21.59,55.88 SENSOR.JP.14 SENSOR.JP.13 | EXT.JP.7 EXT.JP.8 v21.59,109.22 | v13.97,109.22 EXT.JP.2 EXT.JP.1 7.62,104.14 6.35,102.87 | 21.59,55.88 6.35,55.88 v6.35,72.39 6.35,102.87 | PWR.JP.1 64.81,116.2 v57.15,116.2 | 6.35,102.87 6.35,114.94 v7.62,116.2
N$1
  Top 0.61: U2.X.1 LED.X.2.C
N$2
  Top 0.61: LED5.A R1.2
N$3
  Top 0.61: LED.Y.1.A R.Y.1.2
N$4
  Top 0.61: LED5.C 62.23,76.2 FLOOD.1
N$5
  Top 0.61: LED.X.1.A R.X.1.2
N$6
  Top 0.61: COOLANT.JP.1 65.42,102.87 67.31,102.87 68.58,101.6 68.58,90.17 67,88.59 FLOOD.3
N$7
  Top 0.61: LED.X.2.A R.X.2.2
N$8
  Top 0.61: U1.X.1 LED.X.1.C
N$9
  Top 0.61: MIST.3 60.68,97.2 COOLANT.JP.3
N$10
  Top 0.61: R.Y.2.2 LED.Y.2.A
N$11
  Top 0.61: U2.Y.1 LED.Y.2.C
N$12
  Top 0.61: U1.Y.1 LED.Y.1.C
N$13
  Top 0.61: FLOOD.4 62.23,90.17 63.5,91.44 66.04,91.44 67.31,92.71 67.31,99.06 66.63,99.74 COOLANT.JP.2
N$14
  Top 0.61: LED.Z.1.A R.Z.1.2
N$15
  Top 0.61: MIST.4 57.15,93.98 58.42,92.71 62.88,92.71 COOLANT.JP.4
N$16
  Top 0.61: LED.Z.2.A R.Z.2.2 17.78,73.66
N$17
  Top 0.61: U2.Z.1 LED.Z.2.C
N$18
  Top 0.61: LED.Z.1.C U1.Z.1
N$19
  Top 0.61: LED2.C ABORT.1
N$20  (via drill 0.6 pad 1.93)
  Top 0.61: R5.1 v35.56,39.37
  Bottom 0.61: v35.56,39.37 JP1.3
N$21  (via drill 0.6 pad 1.93)
  Top 0.61: R3.1 v35.56,34.29
  Bottom 0.61: v35.56,34.29 38.1,31.75 JP1.5
N$22
  Top 0.61: LED1.C HOLD.1
N$23
  Top 0.61: LED1.A R5.2
N$24
  Top 0.61: R4.2 LED2.A
N$30  (via drill 0.6 pad 1.93)
  Top 0.61: R4.1 v35.56,44.45
  Bottom 0.61: v35.56,44.45 39.37,44.45 40.64,43.18 JP1.1
N$31  (via drill 0.6 pad 1.93)
  Top 0.61: R2.1 v35.56,29.21
  Bottom 0.61: v35.56,29.21 JP1.7
N$32
  Top 0.61: LED3.A R3.2
N$33
  Top 0.61: START.1 LED3.C
N$34
  Top 0.61: LED4.C SAFETY.DOOR.1
N$35
  Top 0.61: R2.2 LED4.A
N$36
  Top 0.61: LED6.A R6.2
N$37
  Top 0.61: LED6.C MIST.1
SENSOR.LIMIT.X.1  (via drill 0.6 pad 1.42)
  Top 0.61: v34.29,68.58 33.02,69.85 R.X.1.1
  Bottom 0.406: SENSOR.JP.3 v34.29,68.58
SENSOR.LIMIT.X.2  (via drill 0.6 pad 1.42)
  Top 0.61: v38.1,68.58 R.X.2.1
  Bottom 0.406: SENSOR.JP.4 35.56,62.23 35.56,66.04 v38.1,68.58
SENSOR.LIMIT.Y.1  (via drill 0.6 pad 1.42)
  Top 0.61: v22.86,68.58 R.Y.1.1
  Bottom 0.406: SENSOR.JP.9 26.67,67.31 25.4,68.58 v22.86,68.58
SENSOR.LIMIT.Y.2  (via drill 0.6 pad 1.42)
  Top 0.61: v27.94,68.58 R.Y.2.1
  Bottom 0.406: SENSOR.JP.10 27.94,62.23 v27.94,68.58
SENSOR.LIMIT.Z.1  (via drill 0.6 pad 1.42)
  Top 0.406: v15.24,68.58 15.11,68.58
  Top 0.61: 15.11,68.58 R.Z.1.1
  Bottom 0.406: SENSOR.JP.15 19.05,67.31 17.78,68.58 v15.24,68.58
SENSOR.LIMIT.Z.2  (via drill 0.6 pad 1.42)
  Top 0.406: v20.32,68.58 20.19,68.58
  Top 0.61: 20.19,68.58 R.Z.2.1
  Bottom 0.406: SENSOR.JP.16 20.32,62.23 v20.32,68.58
(copper drawn outside any net)
  shapes: Top area x4